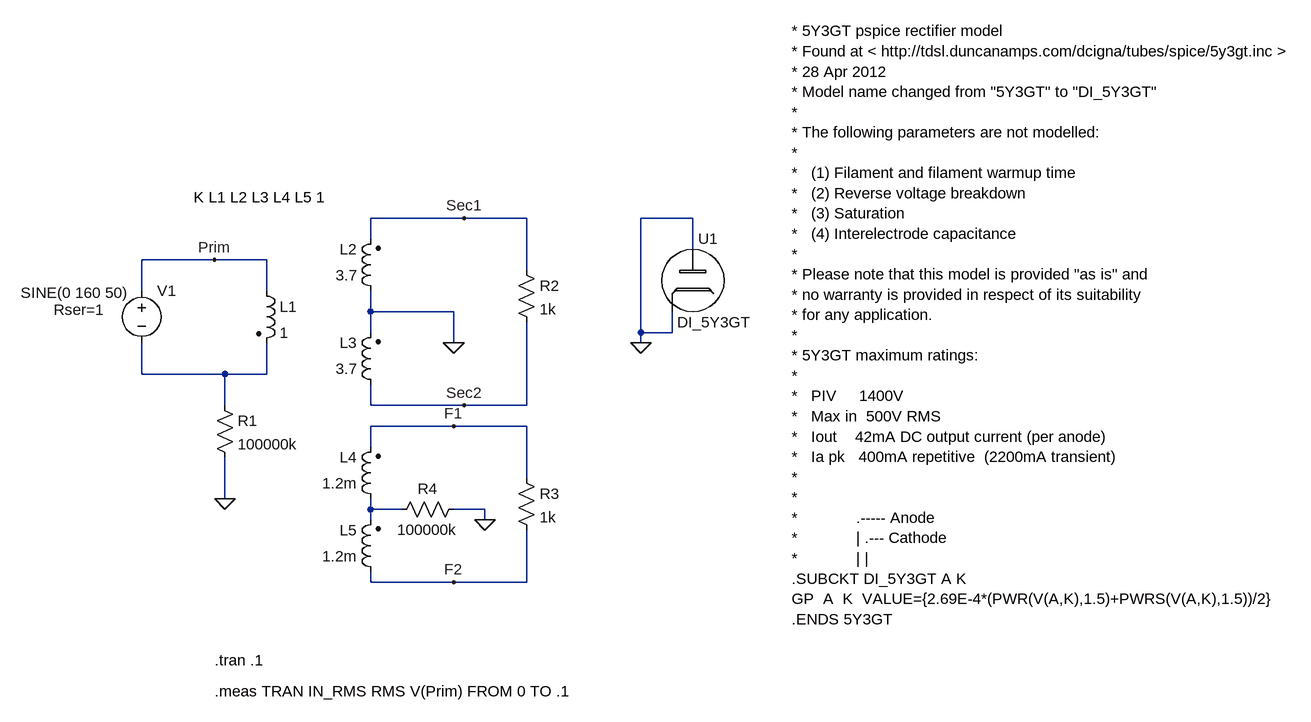
[diagram p0: schematic Ferrix-BL4-2.asc]
Ferrix-BL4-2.asc, the LTspice schematic file:
Version 4
SHEET 1 1812 744
WIRE 448 0 304 0
WIRE 544 0 448 0
WIRE 800 0 720 0
WIRE 304 32 304 0
WIRE 800 48 800 0
WIRE 64 64 -48 64
WIRE 144 64 64 64
WIRE 544 80 544 0
WIRE -48 112 -48 64
WIRE 144 112 144 64
WIRE 304 144 304 112
WIRE 432 144 304 144
WIRE 304 176 304 144
WIRE 720 176 720 0
WIRE 768 176 768 144
WIRE 768 176 720 176
WIRE 432 192 432 144
WIRE 720 192 720 176
WIRE -48 240 -48 192
WIRE 80 240 -48 240
WIRE 144 240 144 192
WIRE 144 240 80 240
WIRE 80 288 80 240
WIRE 304 288 304 256
WIRE 448 288 304 288
WIRE 544 288 544 160
WIRE 544 288 448 288
WIRE 432 320 304 320
WIRE 544 320 432 320
WIRE 304 352 304 320
WIRE 544 400 544 320
WIRE 80 432 80 368
WIRE 304 448 304 432
WIRE 352 448 304 448
WIRE 480 448 432 448
WIRE 304 464 304 448
WIRE 480 464 480 448
WIRE 304 560 304 544
WIRE 432 560 304 560
WIRE 544 560 544 480
WIRE 544 560 432 560
FLAG 80 432 0
FLAG 432 192 0
FLAG 64 64 Prim
FLAG 448 0 Sec1
FLAG 448 288 Sec2
FLAG 720 192 0
FLAG 480 464 0
FLAG 432 320 F1
FLAG 432 560 F2
SYMBOL ind2 320 128 R180
WINDOW 0 36 80 Left 2
WINDOW 3 36 40 Left 2
SYMATTR InstName L2
SYMATTR Value 3.7
SYMBOL ind2 320 272 R180
WINDOW 0 36 80 Left 2
WINDOW 3 36 40 Left 2
SYMATTR InstName L3
SYMATTR Value 3.7
SYMBOL voltage -48 96 R0
WINDOW 123 0 0 Left 0
WINDOW 39 -135 45 Left 2
WINDOW 3 -186 19 Left 2
SYMATTR SpiceLine Rser=1
SYMATTR InstName V1
SYMATTR Value SINE(0 160 50)
SYMBOL res 64 272 R0
SYMATTR InstName R1
SYMATTR Value 100000k
SYMBOL res 528 64 R0
SYMATTR InstName R2
SYMATTR Value 1k
SYMBOL TubeDiode 800 96 R0
SYMATTR InstName U1
SYMATTR Value DI_5Y3GT
SYMBOL ind2 128 96 R0
SYMATTR InstName L1
SYMATTR Value 1
SYMBOL ind2 320 448 R180
WINDOW 0 36 80 Left 2
WINDOW 3 36 40 Left 2
SYMATTR InstName L4
SYMATTR Value 1.2m
SYMBOL ind2 320 560 R180
WINDOW 0 36 80 Left 2
WINDOW 3 36 40 Left 2
SYMATTR InstName L5
SYMATTR Value 1.2m
SYMBOL res 528 384 R0
SYMATTR InstName R3
SYMATTR Value 1k
SYMBOL res 448 432 R90
WINDOW 0 0 56 VBottom 2
WINDOW 3 32 56 VTop 2
SYMATTR InstName R4
SYMATTR Value 100000k
TEXT 32 -32 Left 2 !K L1 L2 L3 L4 L5 1
TEXT 64 680 Left 2 !.tran .1
TEXT 952 -288 Left 2 !* 5Y3GT pspice rectifier model\n* Found at < http://tdsl.duncanamps.com/dcigna/tubes/spice/5y3gt.inc >\n* 28 Apr 2012\n* Model name changed from "5Y3GT" to "DI_5Y3GT"\n*\n* The following parameters are not modelled:\n*\n*   (1) Filament and filament warmup time\n*   (2) Reverse voltage breakdown\n*   (3) Saturation\n*   (4) Interelectrode capacitance\n*\n* Please note that this model is provided "as is" and\n* no warranty is provided in respect of its suitability\n* for any application.\n*\n* 5Y3GT maximum ratings:\n*\n*   PIV     1400V\n*   Max in  500V RMS\n*   Iout    42mA DC output current (per anode)\n*   Ia pk   400mA repetitive  (2200mA transient)\n*\n*\n*             .----- Anode\n*             | .--- Cathode\n*             | |\n.SUBCKT DI_5Y3GT A K\nGP  A  K  VALUE={2.69E-4*(PWR(V(A,K),1.5)+PWRS(V(A,K),1.5))/2}\n.ENDS 5Y3GT
TEXT 64 728 Left 2 !.meas TRAN IN_RMS RMS V(Prim) FROM 0 TO .1

The netlist it stands for:
* Ferrix-BL4-2.asc
L2 0 Sec1 3.7
L3 Sec2 0 3.7
V1 Prim N001 SINE(0 160 50) Rser=1
R1 N001 0 100000k
R2 Sec1 Sec2 1k
XU1 0 0 DI_5Y3GT  ; pins Plate Cathode
L1 Prim N001 1
L4 N002 F1 1.2m
L5 F2 N002 1.2m
R3 F1 F2 1k
R4 0 N002 100000k
K L1 L2 L3 L4 L5 1
.tran .1
* 5Y3GT pspice rectifier model
* Found at < http://tdsl.duncanamps.com/dcigna/tubes/spice/5y3gt.inc >
* 28 Apr 2012
* Model name changed from "5Y3GT" to "DI_5Y3GT"
*
* The following parameters are not modelled:
*
*   (1) Filament and filament warmup time
*   (2) Reverse voltage breakdown
*   (3) Saturation
*   (4) Interelectrode capacitance
*
* Please note that this model is provided "as is" and
* no warranty is provided in respect of its suitability
* for any application.
*
* 5Y3GT maximum ratings:
*
*   PIV     1400V
*   Max in  500V RMS
*   Iout    42mA DC output current (per anode)
*   Ia pk   400mA repetitive  (2200mA transient)
*
*
*             .----- Anode
*             | .--- Cathode
*             | |
.SUBCKT DI_5Y3GT A K
GP  A  K  VALUE={2.69E-4*(PWR(V(A,K),1.5)+PWRS(V(A,K),1.5))/2}
.ENDS 5Y3GT
.meas TRAN IN_RMS RMS V(Prim) FROM 0 TO .1
.backanno
.end